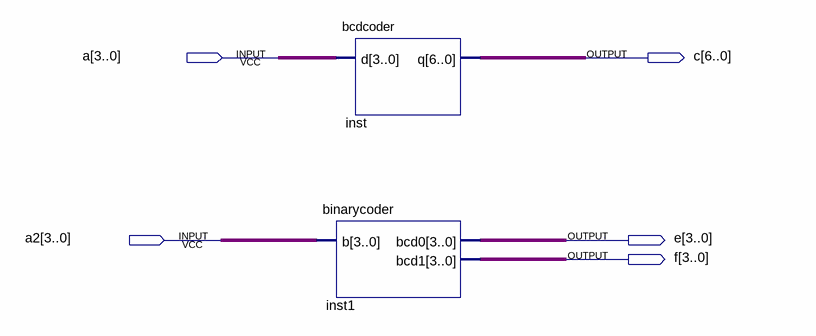
[diagram p0: schematic sheet]
// Quartus schematic top.bdf as structural Verilog: 2 symbols, 5 pins
module top (
  input  [3:0] a,
  input  [3:0] a2,
  output [6:0] c,
  output [3:0] e,
  output [3:0] f
);

  bcdcoder inst (.d(a), .q(c));
  binarycoder inst1 (.b(a2), .bcd0(e), .bcd1(f));
endmodule
